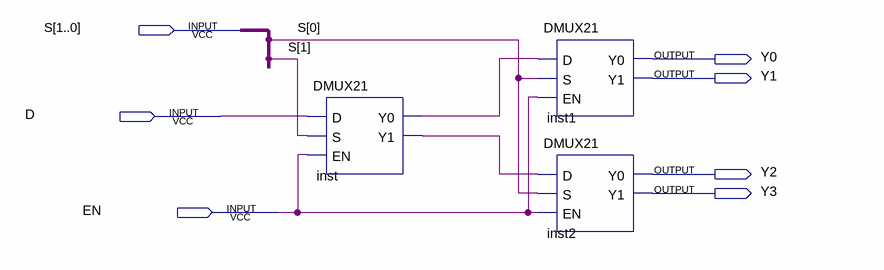
[diagram p0: schematic sheet]
// Quartus schematic DMUX14.bdf as structural Verilog: 3 symbols, 7 pins
module DMUX14 (
  input  [1:0] S,
  input  D,
  input  EN,
  output Y0,
  output Y1,
  output Y2,
  output Y3
);

  wire inst_y0, inst_y1;

  DMUX21 inst (.D(D), .S(S[1]), .EN(EN), .Y0(inst_y0), .Y1(inst_y1));
  DMUX21 inst1 (.D(inst_y0), .S(S[0]), .EN(EN), .Y0(Y0), .Y1(Y1));
  DMUX21 inst2 (.D(inst_y1), .S(S[0]), .EN(EN), .Y0(Y2), .Y1(Y3));
endmodule
